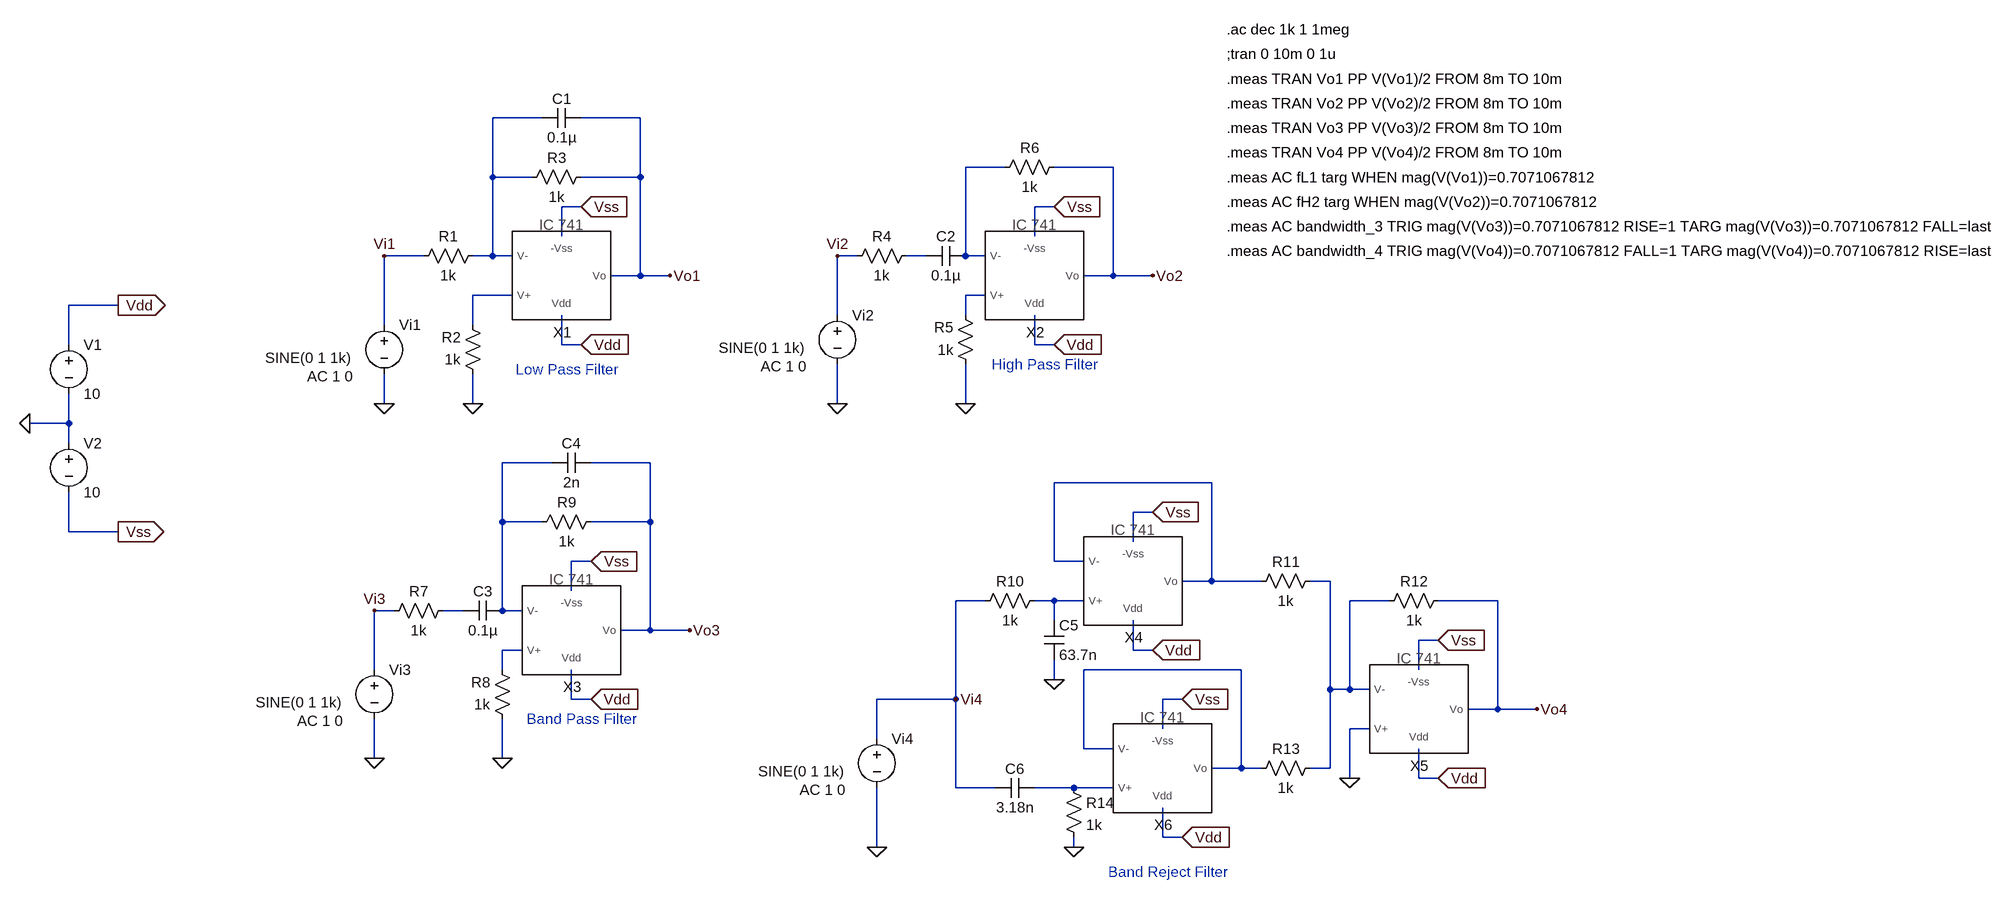
[diagram p0: schematic active filters.asc]
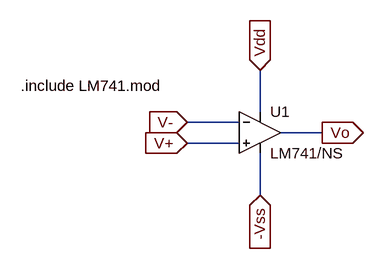
[diagram p1: sub-circuit ic741.asc]
active filters.asc, the LTspice schematic file:
Version 4
SHEET 1 3176 936
WIRE 752 -320 672 -320
WIRE 912 -320 816 -320
WIRE 1504 -240 1440 -240
WIRE 1680 -240 1584 -240
WIRE 672 -224 672 -320
WIRE 736 -224 672 -224
WIRE 912 -224 912 -320
WIRE 912 -224 816 -224
WIRE 816 -176 784 -176
WIRE 1584 -176 1552 -176
WIRE 784 -128 784 -176
WIRE 1552 -128 1552 -176
WIRE 560 -96 496 -96
WIRE 672 -96 672 -224
WIRE 672 -96 640 -96
WIRE 704 -96 672 -96
WIRE 1264 -96 1232 -96
WIRE 1376 -96 1344 -96
WIRE 1440 -96 1440 -240
WIRE 1472 -96 1440 -96
WIRE 912 -64 912 -224
WIRE 912 -64 864 -64
WIRE 960 -64 912 -64
WIRE 1680 -64 1680 -240
WIRE 1680 -64 1632 -64
WIRE 1744 -64 1680 -64
WIRE 704 -32 640 -32
WIRE 1472 -32 1440 -32
WIRE 64 -16 -16 -16
WIRE 1232 0 1232 -96
WIRE 1440 0 1440 -32
WIRE 496 16 496 -96
WIRE 640 16 640 -32
WIRE -16 48 -16 -16
WIRE 784 48 784 0
WIRE 816 48 784 48
WIRE 1552 48 1552 0
WIRE 1584 48 1552 48
WIRE 496 144 496 96
WIRE 640 144 640 96
WIRE 1232 144 1232 80
WIRE 1440 144 1440 80
WIRE -16 176 -16 128
WIRE -16 176 -80 176
WIRE -16 208 -16 176
WIRE 768 240 688 240
WIRE 928 240 832 240
WIRE 1840 272 1584 272
WIRE 1744 320 1712 320
WIRE 688 336 688 240
WIRE 752 336 688 336
WIRE 928 336 928 240
WIRE 928 336 832 336
WIRE -16 352 -16 288
WIRE 64 352 -16 352
WIRE 1712 368 1712 320
WIRE 832 400 800 400
WIRE 1584 400 1584 272
WIRE 1632 400 1584 400
WIRE 1840 432 1840 272
WIRE 1840 432 1792 432
WIRE 1920 432 1840 432
WIRE 2032 432 2000 432
WIRE 800 448 800 400
WIRE 1472 464 1424 464
WIRE 1584 464 1552 464
WIRE 1632 464 1584 464
WIRE 2128 464 2064 464
WIRE 2304 464 2208 464
WIRE 512 480 480 480
WIRE 624 480 592 480
WIRE 688 480 688 336
WIRE 720 480 688 480
WIRE 1584 496 1584 464
WIRE 928 512 928 336
WIRE 928 512 880 512
WIRE 992 512 928 512
WIRE 2208 528 2176 528
WIRE 720 544 688 544
WIRE 1712 544 1712 496
WIRE 1744 544 1712 544
WIRE 480 576 480 480
WIRE 688 576 688 544
WIRE 1888 576 1632 576
WIRE 2176 576 2176 528
WIRE 1584 592 1584 560
WIRE 2032 608 2032 432
WIRE 2064 608 2064 464
WIRE 2064 608 2032 608
WIRE 2096 608 2064 608
WIRE 800 624 800 576
WIRE 832 624 800 624
WIRE 1424 624 1424 464
WIRE 1424 624 1296 624
WIRE 1792 624 1760 624
WIRE 2304 640 2304 464
WIRE 2304 640 2256 640
WIRE 2368 640 2304 640
WIRE 1760 672 1760 624
WIRE 2096 672 2064 672
WIRE 1296 688 1296 624
WIRE 1632 704 1632 576
WIRE 1680 704 1632 704
WIRE 480 720 480 656
WIRE 688 720 688 656
WIRE 1888 736 1888 576
WIRE 1888 736 1840 736
WIRE 1920 736 1888 736
WIRE 2032 736 2032 608
WIRE 2032 736 2000 736
WIRE 2064 752 2064 672
WIRE 2176 752 2176 704
WIRE 2208 752 2176 752
WIRE 1424 768 1424 624
WIRE 1488 768 1424 768
WIRE 1616 768 1552 768
WIRE 1680 768 1616 768
WIRE 1760 848 1760 800
WIRE 1792 848 1760 848
WIRE 1296 864 1296 768
WIRE 1616 864 1616 848
FLAG -80 176 0
FLAG 64 -16 Vdd
IOPIN 64 -16 Out
FLAG 64 352 Vss
IOPIN 64 352 Out
FLAG 960 -64 Vo1
FLAG 640 144 0
FLAG 496 -96 Vi1
FLAG 496 144 0
FLAG 816 -176 Vss
IOPIN 816 -176 In
FLAG 816 48 Vdd
IOPIN 816 48 In
FLAG 1584 -176 Vss
IOPIN 1584 -176 In
FLAG 1584 48 Vdd
IOPIN 1584 48 In
FLAG 832 400 Vss
IOPIN 832 400 In
FLAG 832 624 Vdd
IOPIN 832 624 In
FLAG 1744 320 Vss
IOPIN 1744 320 In
FLAG 1744 544 Vdd
IOPIN 1744 544 In
FLAG 1232 -96 Vi2
FLAG 1232 144 0
FLAG 1440 144 0
FLAG 1744 -64 Vo2
FLAG 480 480 Vi3
FLAG 480 720 0
FLAG 688 720 0
FLAG 992 512 Vo3
FLAG 1584 592 0
FLAG 2208 528 Vss
IOPIN 2208 528 In
FLAG 2208 752 Vdd
IOPIN 2208 752 In
FLAG 2368 640 Vo4
FLAG 1792 624 Vss
IOPIN 1792 624 In
FLAG 1792 848 Vdd
IOPIN 1792 848 In
FLAG 1296 864 0
FLAG 1616 864 0
FLAG 2064 752 0
FLAG 1424 624 Vi4
SYMBOL voltage -16 32 R0
WINDOW 123 0 0 Left 0
WINDOW 39 0 0 Left 0
SYMATTR InstName V1
SYMATTR Value 10
SYMBOL voltage -16 192 R0
WINDOW 123 0 0 Left 0
WINDOW 39 0 0 Left 0
SYMATTR InstName V2
SYMATTR Value 10
SYMBOL IC741 784 -80 M180
SYMATTR InstName X1
SYMBOL res 656 -112 R90
WINDOW 0 0 56 VBottom 2
WINDOW 3 32 56 VTop 2
SYMATTR InstName R1
SYMATTR Value 1k
SYMBOL res 656 112 R180
WINDOW 0 36 76 Left 2
WINDOW 3 36 40 Left 2
SYMATTR InstName R2
SYMATTR Value 1k
SYMBOL res 720 -208 R270
WINDOW 0 32 56 VTop 2
WINDOW 3 0 56 VBottom 2
SYMATTR InstName R3
SYMATTR Value 1k
SYMBOL voltage 496 0 R0
WINDOW 3 -193 69 Left 2
WINDOW 123 -125 99 Left 2
WINDOW 39 0 0 Left 0
SYMATTR Value SINE(0 1 1k)
SYMATTR Value2 AC 1 0
SYMATTR InstName Vi1
SYMBOL cap 816 -336 R90
WINDOW 0 0 32 VBottom 2
WINDOW 3 32 32 VTop 2
SYMATTR InstName C1
SYMATTR Value 0.1µ
SYMBOL IC741 1552 -80 M180
SYMATTR InstName X2
SYMBOL IC741 800 496 M180
SYMATTR InstName X3
SYMBOL IC741 1712 416 M180
SYMATTR InstName X4
SYMBOL cap 1440 -112 R90
WINDOW 0 0 32 VBottom 2
WINDOW 3 32 32 VTop 2
SYMATTR InstName C2
SYMATTR Value 0.1µ
SYMBOL res 1360 -112 R90
WINDOW 0 0 56 VBottom 2
WINDOW 3 32 56 VTop 2
SYMATTR InstName R4
SYMATTR Value 1k
SYMBOL res 1456 96 R180
WINDOW 0 36 76 Left 2
WINDOW 3 36 40 Left 2
SYMATTR InstName R5
SYMATTR Value 1k
SYMBOL res 1600 -256 R90
WINDOW 0 0 56 VBottom 2
WINDOW 3 32 56 VTop 2
SYMATTR InstName R6
SYMATTR Value 1k
SYMBOL voltage 1232 -16 R0
WINDOW 3 -193 69 Left 2
WINDOW 123 -125 99 Left 2
WINDOW 39 0 0 Left 0
SYMATTR Value SINE(0 1 1k)
SYMATTR Value2 AC 1 0
SYMATTR InstName Vi2
SYMBOL cap 688 464 R90
WINDOW 0 0 32 VBottom 2
WINDOW 3 32 32 VTop 2
SYMATTR InstName C3
SYMATTR Value 0.1µ
SYMBOL res 608 464 R90
WINDOW 0 0 56 VBottom 2
WINDOW 3 32 56 VTop 2
SYMATTR InstName R7
SYMATTR Value 1k
SYMBOL res 704 672 R180
WINDOW 0 36 76 Left 2
WINDOW 3 36 40 Left 2
SYMATTR InstName R8
SYMATTR Value 1k
SYMBOL res 848 320 R90
WINDOW 0 0 56 VBottom 2
WINDOW 3 32 56 VTop 2
SYMATTR InstName R9
SYMATTR Value 1k
SYMBOL voltage 480 560 R0
WINDOW 3 -193 69 Left 2
WINDOW 123 -125 99 Left 2
WINDOW 39 0 0 Left 0
SYMATTR Value SINE(0 1 1k)
SYMATTR Value2 AC 1 0
SYMATTR InstName Vi3
SYMBOL cap 832 224 R90
WINDOW 0 0 32 VBottom 2
WINDOW 3 32 32 VTop 2
SYMATTR InstName C4
SYMATTR Value 2n
SYMBOL res 1568 448 R90
WINDOW 0 0 56 VBottom 2
WINDOW 3 32 56 VTop 2
SYMATTR InstName R10
SYMATTR Value 1k
SYMBOL cap 1568 496 R0
SYMATTR InstName C5
SYMATTR Value 63.7n
SYMBOL IC741 2176 624 M180
SYMATTR InstName X5
SYMBOL res 2016 416 R90
WINDOW 0 0 56 VBottom 2
WINDOW 3 32 56 VTop 2
SYMATTR InstName R11
SYMATTR Value 1k
SYMBOL res 2224 448 R90
WINDOW 0 0 56 VBottom 2
WINDOW 3 32 56 VTop 2
SYMATTR InstName R12
SYMATTR Value 1k
SYMBOL IC741 1760 720 M180
SYMATTR InstName X6
SYMBOL cap 1552 752 R90
WINDOW 0 0 32 VBottom 2
WINDOW 3 32 32 VTop 2
SYMATTR InstName C6
SYMATTR Value 3.18n
SYMBOL voltage 1296 672 R0
WINDOW 3 -193 69 Left 2
WINDOW 123 -125 99 Left 2
WINDOW 39 0 0 Left 0
SYMATTR Value SINE(0 1 1k)
SYMATTR Value2 AC 1 0
SYMATTR InstName Vi4
SYMBOL res 2016 720 R90
WINDOW 0 0 56 VBottom 2
WINDOW 3 32 56 VTop 2
SYMATTR InstName R13
SYMATTR Value 1k
SYMBOL res 1600 752 R0
SYMATTR InstName R14
SYMATTR Value 1k
TEXT 792 88 Center 2 ;Low Pass Filter
TEXT 1864 -464 Left 2 !.ac dec 1k 1 1meg
TEXT 1864 -424 Left 2 !;tran 0 10m 0 1u
TEXT 1568 80 Center 2 ;High Pass Filter
TEXT 816 656 Center 2 ;Band Pass Filter
TEXT 1768 904 Center 2 ;Band Reject Filter
TEXT 1864 -384 Left 2 !.meas TRAN Vo1 PP V(Vo1)/2 FROM 8m TO 10m
TEXT 1864 -344 Left 2 !.meas TRAN Vo2 PP V(Vo2)/2 FROM 8m TO 10m
TEXT 1864 -304 Left 2 !.meas TRAN Vo3 PP V(Vo3)/2 FROM 8m TO 10m
TEXT 1864 -264 Left 2 !.meas TRAN Vo4 PP V(Vo4)/2 FROM 8m TO 10m
TEXT 1864 -224 Left 2 !.meas AC fL1 targ WHEN mag(V(Vo1))=0.7071067812
TEXT 1864 -184 Left 2 !.meas AC fH2 targ WHEN mag(V(Vo2))=0.7071067812
TEXT 1864 -144 Left 2 !.meas AC bandwidth_3 TRIG mag(V(Vo3))=0.7071067812 RISE=1 TARG mag(V(Vo3))=0.7071067812 FALL=last
TEXT 1864 -104 Left 2 !.meas AC bandwidth_4 TRIG mag(V(Vo4))=0.7071067812 FALL=1 TARG mag(V(Vo4))=0.7071067812 RISE=last

ic741.asc, the sub-circuit schematic file:
Version 4
SHEET 1 880 680
WIRE 368 128 368 64
WIRE 336 144 256 144
WIRE 464 160 400 160
WIRE 336 176 256 176
WIRE 368 256 368 192
FLAG 464 160 Vo
IOPIN 464 160 Out
FLAG 368 64 Vdd
IOPIN 368 64 In
FLAG 368 256 -Vss
IOPIN 368 256 In
FLAG 256 176 V+
IOPIN 256 176 In
FLAG 256 144 V-
IOPIN 256 144 In
SYMBOL OpAmps\\opamp2 368 96 R0
SYMATTR InstName U1
SYMATTR Value LM741/NS
TEXT 0 88 Left 2 !.include LM741.mod

The netlist it stands for:
* active filters.asc
V1 Vdd 0 10
V2 0 Vss 10
XX1 Vss N004 N001 Vdd Vo1 ic741
R1 N001 Vi1 1k
R2 0 N004 1k
R3 N001 Vo1 1k
Vi1 Vi1 0 SINE(0 1 1k) AC 1 0
C1 Vo1 N001 0.1µ
XX2 Vss N005 N002 Vdd Vo2 ic741
XX3 Vss N011 N006 Vdd Vo3 ic741
XX4 Vss N009 N007 Vdd N007 ic741
C2 N002 N003 0.1µ
R4 N003 Vi2 1k
R5 0 N005 1k
R6 Vo2 N002 1k
Vi2 Vi2 0 SINE(0 1 1k) AC 1 0
C3 N006 N010 0.1µ
R7 N010 Vi3 1k
R8 0 N011 1k
R9 Vo3 N006 1k
Vi3 Vi3 0 SINE(0 1 1k) AC 1 0
C4 Vo3 N006 2n
R10 N009 Vi4 1k
C5 N009 0 63.7n
XX5 Vss 0 N008 Vdd Vo4 ic741
R11 N008 N007 1k
R12 Vo4 N008 1k
XX6 Vss N013 N012 Vdd N012 ic741
C6 N013 Vi4 3.18n
Vi4 Vi4 0 SINE(0 1 1k) AC 1 0
R13 N008 N012 1k
R14 N013 0 1k

* block symbol definitions
.subckt ic741 -Vss V+ V- Vdd Vo
XU1 V+ V- Vdd -Vss Vo LM741/NS  ; pins In+ In- V+ V- OUT
.include LM741.mod
.ends ic741

* Low Pass Filter
.ac dec 1k 1 1meg
;tran 0 10m 0 1u
* High Pass Filter
* Band Pass Filter
* Band Reject Filter
.meas TRAN Vo1 PP V(Vo1)/2 FROM 8m TO 10m
.meas TRAN Vo2 PP V(Vo2)/2 FROM 8m TO 10m
.meas TRAN Vo3 PP V(Vo3)/2 FROM 8m TO 10m
.meas TRAN Vo4 PP V(Vo4)/2 FROM 8m TO 10m
.meas AC fL1 targ WHEN mag(V(Vo1))=0.7071067812
.meas AC fH2 targ WHEN mag(V(Vo2))=0.7071067812
.meas AC bandwidth_3 TRIG mag(V(Vo3))=0.7071067812 RISE=1 TARG mag(V(Vo3))=0.7071067812 FALL=last
.meas AC bandwidth_4 TRIG mag(V(Vo4))=0.7071067812 FALL=1 TARG mag(V(Vo4))=0.7071067812 RISE=last
.backanno
.end